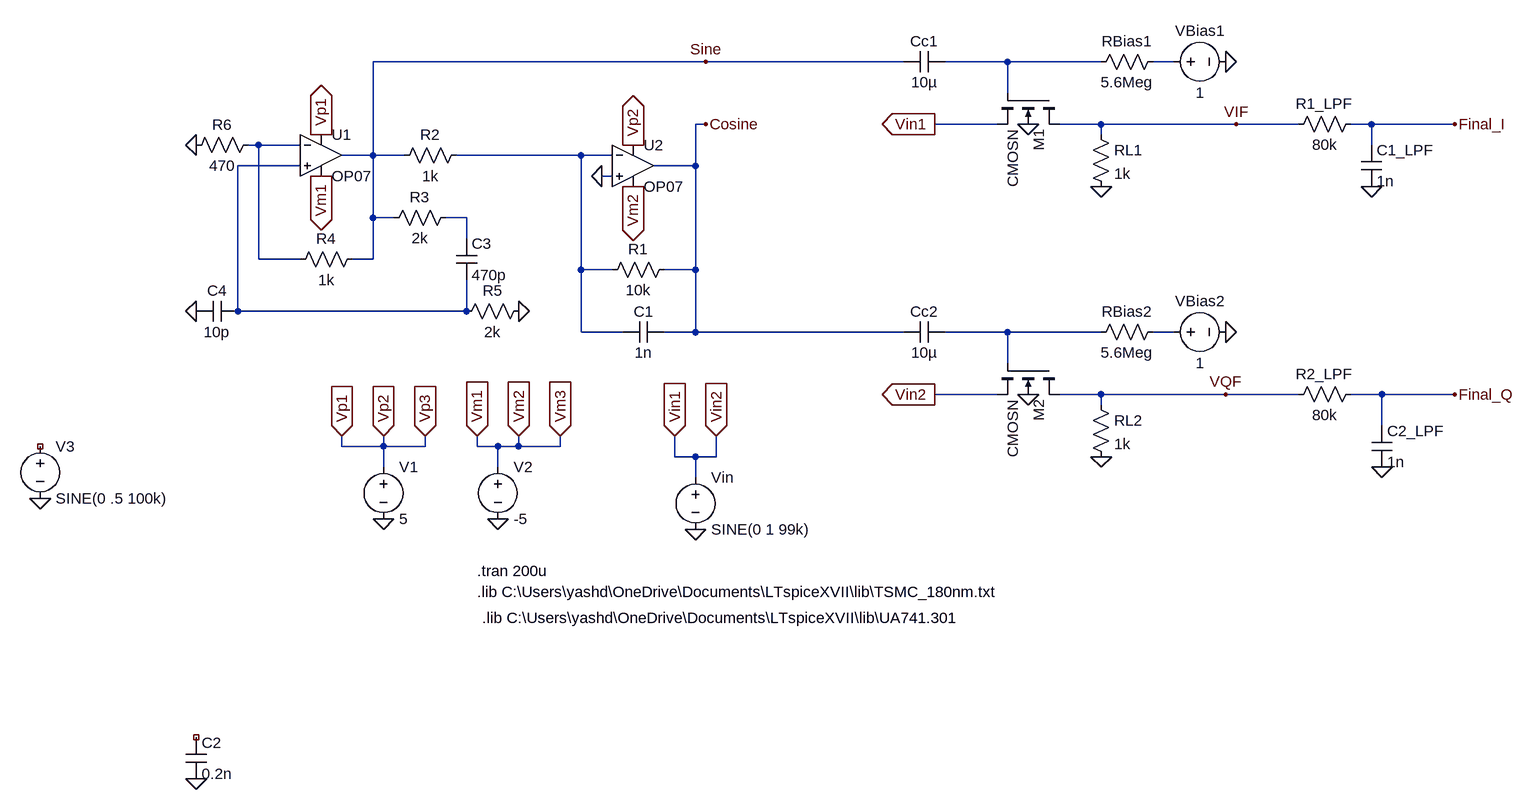
[diagram p0: schematic LTspice_Quadrature_Down_Oscillator.asc]
LTspice_Quadrature_Down_Oscillator.asc, the LTspice schematic file:
Version 4
SHEET 1 3992 1188
WIRE 608 64 96 64
WIRE 912 64 608 64
WIRE 1072 64 976 64
WIRE 1216 64 1072 64
WIRE 1328 64 1296 64
WIRE 1072 112 1072 64
WIRE 608 160 592 160
WIRE 1056 160 960 160
WIRE 1216 160 1152 160
WIRE 1424 160 1216 160
WIRE 1520 160 1424 160
WIRE 1632 160 1600 160
WIRE 1760 160 1632 160
WIRE 1216 176 1216 160
WIRE -80 192 -96 192
WIRE -16 192 -80 192
WIRE 1632 192 1632 160
WIRE 96 208 96 64
WIRE 96 208 48 208
WIRE 144 208 96 208
WIRE 416 208 224 208
WIRE 464 208 416 208
WIRE -16 224 -112 224
WIRE 592 224 592 160
WIRE 592 224 528 224
WIRE 464 240 448 240
WIRE 96 304 96 208
WIRE 128 304 96 304
WIRE 240 304 208 304
WIRE 240 336 240 304
WIRE -80 368 -80 192
WIRE -16 368 -80 368
WIRE 96 368 96 304
WIRE 96 368 64 368
WIRE 416 384 416 208
WIRE 464 384 416 384
WIRE 592 384 592 224
WIRE 592 384 544 384
WIRE -112 448 -112 224
WIRE 240 448 240 400
WIRE 240 448 -112 448
WIRE 416 480 416 384
WIRE 480 480 416 480
WIRE 592 480 592 384
WIRE 592 480 544 480
WIRE 912 480 592 480
WIRE 1072 480 976 480
WIRE 1216 480 1072 480
WIRE 1328 480 1296 480
WIRE 1072 528 1072 480
WIRE 1056 576 960 576
WIRE 1216 576 1152 576
WIRE 1408 576 1216 576
WIRE 1520 576 1408 576
WIRE 1648 576 1600 576
WIRE 1760 576 1648 576
WIRE 1216 592 1216 576
WIRE 1648 624 1648 576
WIRE 48 656 48 640
WIRE 112 656 112 640
WIRE 112 656 48 656
WIRE 176 656 176 640
WIRE 176 656 112 656
WIRE 256 656 256 640
WIRE 288 656 256 656
WIRE 320 656 320 640
WIRE 320 656 288 656
WIRE 384 656 384 640
WIRE 384 656 320 656
WIRE 560 672 560 640
WIRE 592 672 560 672
WIRE 624 672 624 640
WIRE 624 672 592 672
WIRE 112 688 112 656
WIRE 288 688 288 656
WIRE 592 704 592 672
FLAG -176 1168 0
FLAG 112 768 0
FLAG 288 768 0
FLAG 48 640 Vp1
IOPIN 48 640 In
FLAG 112 640 Vp2
IOPIN 112 640 In
FLAG 176 640 Vp3
IOPIN 176 640 In
FLAG 256 640 Vm1
IOPIN 256 640 In
FLAG 320 640 Vm2
IOPIN 320 640 In
FLAG 384 640 Vm3
IOPIN 384 640 In
FLAG 608 64 Sine
FLAG 608 160 Cosine
FLAG 16 176 Vp1
IOPIN 16 176 Out
FLAG 496 192 Vp2
IOPIN 496 192 Out
FLAG 16 240 Vm1
IOPIN 16 240 Out
FLAG 496 256 Vm2
IOPIN 496 256 Out
FLAG 592 784 0
FLAG 1408 64 0
FLAG 560 640 Vin1
IOPIN 560 640 In
FLAG 624 640 Vin2
IOPIN 624 640 In
FLAG 960 160 Vin1
IOPIN 960 160 Out
FLAG 1104 160 0
FLAG 1216 256 0
FLAG 1408 480 0
FLAG 960 576 Vin2
IOPIN 960 576 Out
FLAG 1104 576 0
FLAG 1216 672 0
FLAG 1760 160 Final_I
FLAG 1760 576 Final_Q
FLAG 1632 256 0
FLAG 1648 688 0
FLAG 1424 160 VIF
FLAG 1408 576 VQF
FLAG -416 736 0
FLAG 448 240 0
FLAG 320 448 0
FLAG -176 448 0
FLAG -176 192 0
SYMBOL OpAmps\\OP07 16 144 R0
SYMATTR InstName U1
SYMBOL OpAmps\\OP07 496 160 R0
SYMATTR InstName U2
SYMBOL res 240 192 R90
WINDOW 0 0 56 VBottom 2
WINDOW 3 32 56 VTop 2
SYMATTR InstName R2
SYMATTR Value 1k
SYMBOL cap -192 1104 R0
SYMATTR InstName C2
SYMATTR Value 0.2n
SYMBOL voltage 112 672 R0
WINDOW 123 0 0 Left 0
WINDOW 39 0 0 Left 0
SYMATTR InstName V1
SYMATTR Value 5
SYMBOL voltage 288 672 R0
WINDOW 123 0 0 Left 0
WINDOW 39 0 0 Left 0
SYMATTR InstName V2
SYMATTR Value -5
SYMBOL nmos4 1152 112 R90
SYMATTR InstName M1
SYMATTR Value CMOSN
SYMBOL cap 976 48 R90
WINDOW 0 0 32 VBottom 2
WINDOW 3 32 32 VTop 2
SYMATTR InstName Cc1
SYMATTR Value 10µ
SYMBOL res 1312 48 R90
WINDOW 0 0 56 VBottom 2
WINDOW 3 32 56 VTop 2
SYMATTR InstName RBias1
SYMATTR Value 5.6Meg
SYMBOL voltage 1312 64 R270
WINDOW 0 32 56 VTop 2
WINDOW 3 -32 56 VBottom 2
SYMATTR InstName VBias1
SYMATTR Value 1
SYMBOL voltage 592 688 R0
WINDOW 123 0 0 Left 0
WINDOW 39 0 0 Left 0
SYMATTR InstName Vin
SYMATTR Value SINE(0 1 99k)
SYMBOL res 1200 160 R0
SYMATTR InstName RL1
SYMATTR Value 1k
SYMBOL nmos4 1152 528 R90
SYMATTR InstName M2
SYMATTR Value CMOSN
SYMBOL cap 976 464 R90
WINDOW 0 0 32 VBottom 2
WINDOW 3 32 32 VTop 2
SYMATTR InstName Cc2
SYMATTR Value 10µ
SYMBOL res 1312 464 R90
WINDOW 0 0 56 VBottom 2
WINDOW 3 32 56 VTop 2
SYMATTR InstName RBias2
SYMATTR Value 5.6Meg
SYMBOL voltage 1312 480 R270
WINDOW 0 32 56 VTop 2
WINDOW 3 -32 56 VBottom 2
SYMATTR InstName VBias2
SYMATTR Value 1
SYMBOL res 1200 576 R0
SYMATTR InstName RL2
SYMATTR Value 1k
SYMBOL res 1616 144 R90
WINDOW 0 0 56 VBottom 2
WINDOW 3 32 56 VTop 2
SYMATTR InstName R1_LPF
SYMATTR Value 80k
SYMBOL res 1616 560 R90
WINDOW 0 0 56 VBottom 2
WINDOW 3 32 56 VTop 2
SYMATTR InstName R2_LPF
SYMATTR Value 80k
SYMBOL cap 1616 192 R0
SYMATTR InstName C1_LPF
SYMATTR Value 1n
SYMBOL cap 1632 624 R0
SYMATTR InstName C2_LPF
SYMATTR Value 1n
SYMBOL voltage -416 640 R0
WINDOW 123 0 0 Left 0
WINDOW 39 0 0 Left 0
SYMATTR InstName V3
SYMATTR Value SINE(0 .5 100k)
SYMBOL res 560 368 R90
WINDOW 0 0 56 VBottom 2
WINDOW 3 32 56 VTop 2
SYMATTR InstName R1
SYMATTR Value 10k
SYMBOL cap 544 464 R90
WINDOW 0 0 32 VBottom 2
WINDOW 3 32 32 VTop 2
SYMATTR InstName C1
SYMATTR Value 1n
SYMBOL res 224 288 R90
WINDOW 0 0 56 VBottom 2
WINDOW 3 32 56 VTop 2
SYMATTR InstName R3
SYMATTR Value 2k
SYMBOL res 80 352 R90
WINDOW 0 0 56 VBottom 2
WINDOW 3 32 56 VTop 2
SYMATTR InstName R4
SYMATTR Value 1k
SYMBOL res 336 432 R90
WINDOW 0 0 56 VBottom 2
WINDOW 3 32 56 VTop 2
SYMATTR InstName R5
SYMATTR Value 2k
SYMBOL cap 224 336 R0
SYMATTR InstName C3
SYMATTR Value 470p
SYMBOL cap -112 432 R90
WINDOW 0 0 32 VBottom 2
WINDOW 3 32 32 VTop 2
SYMATTR InstName C4
SYMATTR Value 10p
SYMBOL res -80 176 R90
WINDOW 0 0 56 VBottom 2
WINDOW 3 32 56 VTop 2
SYMATTR InstName R6
SYMATTR Value 470
TEXT 256 848 Left 2 !.tran 200u
TEXT 256 880 Left 2 !.lib C:\\Users\\yashd\\OneDrive\\Documents\\LTspiceXVII\\lib\\TSMC_180nm.txt
TEXT 264 920 Left 2 !.lib C:\\Users\\yashd\\OneDrive\\Documents\\LTspiceXVII\\lib\\UA741.301

The netlist it stands for:
* LTspice_Quadrature_Down_Oscillator.asc
XU1 N005 N003 Vp3 Vm3 Sine LT1001  ; OP07, pins In+ In- V+ V- OUT
XU2 0 N004 Vp3 Vm3 Cosine LT1001  ; OP07, pins In+ In- V+ V- OUT
R2 N004 Sine 1k
C2 NC_01 0 0.2n
V1 Vp3 0 5
V2 Vm3 0 -5
M1 VIF N001 Vin2 0 CMOSN
Cc1 N001 Sine 10µ
RBias1 N002 N001 5.6Meg
VBias1 N002 0 1
Vin Vin2 0 SINE(0 1 99k)
RL1 VIF 0 1k
M2 VQF N007 Vin2 0 CMOSN
Cc2 N007 Cosine 10µ
RBias2 N008 N007 5.6Meg
VBias2 N008 0 1
RL2 VQF 0 1k
R1_LPF Final_I VIF 80k
R2_LPF Final_Q VQF 80k
C1_LPF Final_I 0 1n
C2_LPF Final_Q 0 1n
V3 NC_02 0 SINE(0 .5 100k)
R1 Cosine N004 10k
C1 Cosine N004 1n
R3 N006 Sine 2k
R4 Sine N003 1k
R5 0 N005 2k
C3 N006 N005 470p
C4 N005 0 10p
R6 N003 0 470
.model NMOS NMOS
.model PMOS PMOS
.lib standard.mos
.tran 200u
.lib C:\Users\yashd\OneDrive\Documents\LTspiceXVII\lib\TSMC_180nm.txt
.lib C:\Users\yashd\OneDrive\Documents\LTspiceXVII\lib\UA741.301
.lib LTC.lib
.backanno
.end